# EAGLE design testsch (EAGLE 9.5.2)
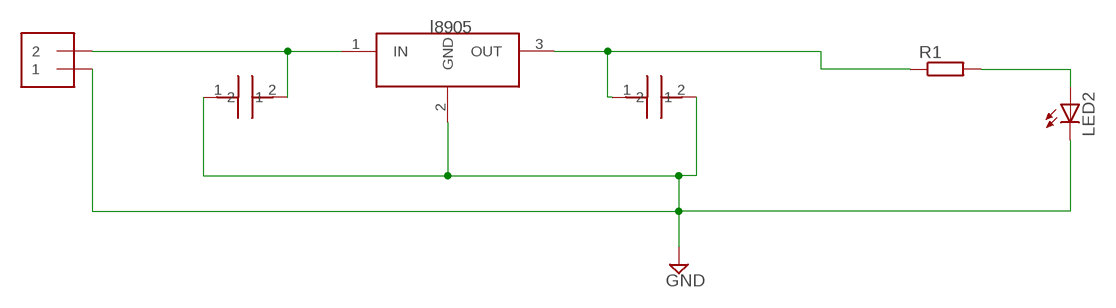
[diagram p0: schematic, sheet 1]

## Parts
J1  1X2-3.5MM  [1X2-3.5MM]
LED2  LEDSMT1206  [1206]
R1  R-EU_M1206  [M1206]
U$1  L7805TESTA  [L7805]
U$2  0.33UF_CUSTOM  [C1206]
U$3  0.33UF_CUSTOM  [C1206]

## Nets
GND: J1.1 LED2.C U$1.2(GND) U$2.1 U$3.2
N$1: J1.2 U$1.1(IN) U$2.2
N$2: LED2.A R1.2
N$3: R1.1 U$1.3(OUT) U$3.1

## Library data of the parts
J1 = adafruit:1X2: 3.5mm Terminal block http://www.ladyada.net/library/pcb/eaglelibrary.html
LED2 = adafruit:LED: LED OSRAM: - CHIPLED LG R971, LG N971, LY N971, LG Q971, LY Q971, LO R971, LY R971 LH N974, LH R974 LS Q976, LO Q976, LY Q976 LO Q996 - Hyper CHIPLED LW Q18S LB Q993, LB Q99A, LB R99A - SideLED LS A670, LO A670, LY A670, LG A670, LP A670 LB A673, LV A673, LT A673, LW A673 LH A674 LY A675 LS A676, LA A676, LO A676, LY A676, LW A676 LS A679, LY A679, LG A679 - Hyper Micro SIDELED® LS Y876, LA Y876, LO Y876, LY Y876 LT Y87S - SmartLED LW L88C, LW L88S LB L89C, LB L89S, LG L890 LS L89K, LO L89K, LY L89K LS L896, LA L896, LO L896, LY L896 - TOPLED LS T670, LO T670, LY T670, LG T670, LP T670 LSG T670, LSP T670, LSY T670, LOP T670, LYG T670 LG T671, LOG T671, LSG T671 LB T673, LV T673, LT T673, LW T673 LH T674 LS T676, LA T676, LO T676, LY T676, LB T676, LH T676, LSB T676, LW T676 LB T67C, LV T67C, LT T67C, LS T67K, LO T67K, LY T67K, LW E67C LS E67B, LA E67B, LO E67B, LY E67B, LB E67C, LV E67C, LT E67C LW T67C LS T679, LY T679, LG T679 LS T770, LO T770, LY T770, LG T770, LP T770 LB T773, LV T773, LT T773, LW T773 LH T774 LS E675, LA E675, LY E675, LS T675 LS T776, LA T776, LO T776, LY T776, LB T776 LHGB T686 LT T68C, LB T68C - Hyper Mini TOPLED® LB M676 - Mini TOPLED Santana® LG M470 LS M47K, LO M47K, LY M47K Source: http://www.osram.convergy.de/
R1 = resistor:R-EU_: RESISTOR, European symbol
U$1 = devicetest:L7805TEST
U$2 U$3 = devicetest:0.33UF_CUSTOM

## Board
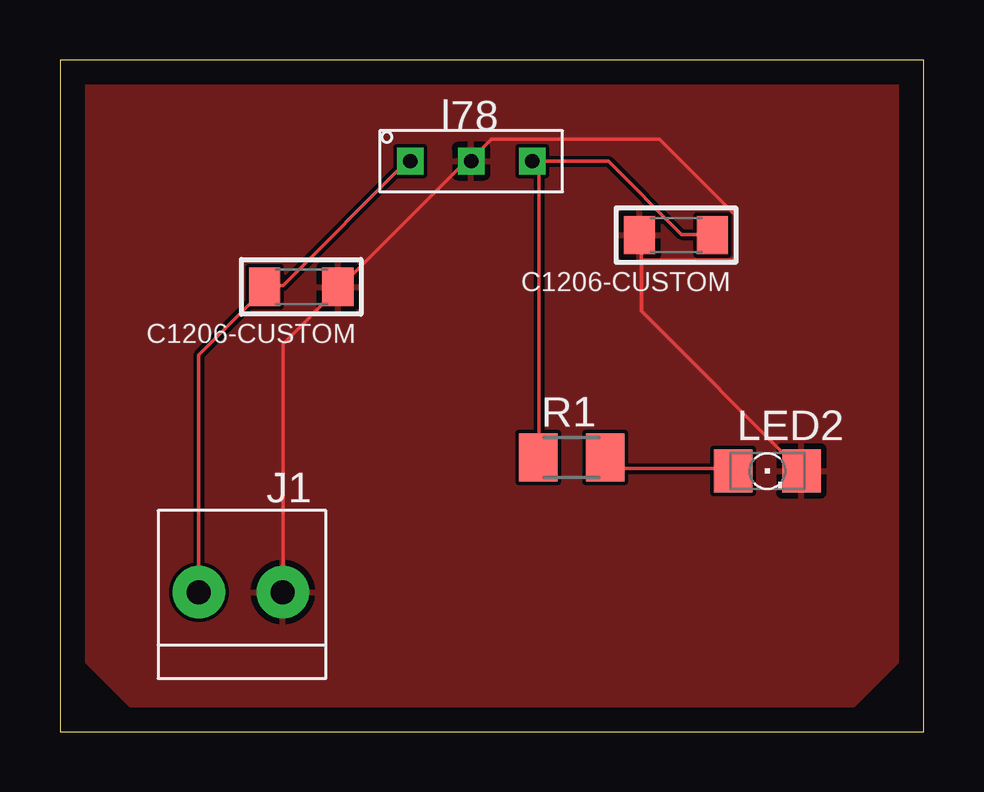
[diagram p1: board, top side]

Size 36 x 28 mm. Coordinates in mm from the lower left corner, seen from the top.
Outline: 0,0 36,0 36,28 0,28 0,0
Copper layers (1*16): Top 0.035mm / dielectric 1.5mm / Bottom 0.035mm
Design rules "default": minimum track width 6mil, minimum drill 0.35mm, track to track 6mil, track to pad 6mil, pad to pad 6mil, via to via 6mil, smd to smd 6mil, copper to edge 40mil, drill to drill 6mil, minimum pad ring 10mil, minimum via ring 8mil, stop-mask expansion 4mil, vias tented up to drill 0mil, thermal gap 10mil

### Footprints (pad centres in the part's own frame; a part is rotated, then mirrored left to right if it is on the bottom)
1X2-3.5MM = drill 1 pad 2.184: 1 1.8,0; 2 -1.7,0
1206 = smd 1.6 x 1.803: A -1.422,0; C 1.422,0
M1206 = smd 1.6 x 2: 1 -1.4,0; 2 1.4,0
L7805 = drill 0.6 square: 1 -11.43,0; 2 -8.89,0; 3 -6.35,0
C1206 = smd 1.3 x 1.6: 1 -1.524,0; 2 1.524,0

### Placement (x,y rotation side)
J1  7.49,5.81 0 top
LED2  29.49,10.86 0 top
R1  21.33,11.43 0 top
U$1  26.03,23.78 0 top
U$2  10.06,18.54 180 top
U$3  25.68,20.7 180 top

### Tracks (layer width: path | path; a pad name or v marks a point on that pad's centre or on a via)
GND
  Top 0.152: 24.23,19.66 24.23,17.53 30.79,10.97 LED2.C | 24.23,19.66 24.23,20.57 U$3.2 | J1.1 9.3,5.94 9.3,16.15 11.58,18.44 U$2.1 11.73,18.59 17.07,23.93 U$1.2 17.22,23.93 17.98,24.69 24.99,24.69 28.19,21.49 28.19,19.81 28.04,19.66 24.23,19.66
  pour Top: 0,28 35,28 35,3 32,0 4,0 0,4
N$1
  Top 0.152: U$1.1 14.48,23.77 9.3,18.59 8.69,18.59 U$2.2 8.53,18.44 5.79,15.7 5.79,5.94 J1.2
N$2
  Top 0.152: LED2.A 28.04,10.97 23.32,10.97 22.86,11.43 R1.2
N$3
  Top 0.152: 19.96,23.77 19.81,23.77 U$1.3 19.96,23.77 | 19.96,23.77 22.86,23.77 25.91,20.73 27.13,20.73 U$3.1 | 19.96,23.77 19.96,11.43 R1.1